# Altium schematic sheet tachometer.SchDoc
size A4; SheetNumber: 1; SheetTotal: 1
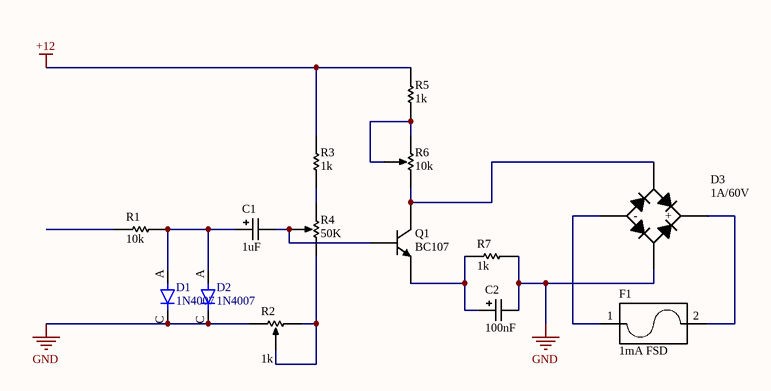
[diagram p0: tachometer.SchDoc]

## Parts
C1  1uF  [CAPAE660X660R_PAN]
C2  100nF  [CAPAE660X660R_PAN]
D1  1N4007  [DIOAD1060W80L520D270]
D2  1N4007  [DIOAD1060W80L520D270]
D3  1A/60V  [SOIC127P670X270-8N_MCC]
F1  1mA FSD  [NANO-452_LIT]
Q1  BC107  [SOT95P230X110-3N_PHY]
R1  10k  [RESC1508X05R_VIS]
R2  1k  [TRIM_ST4ETB503_COP]
R3  1k  [RESC1508X05R_VIS]
R4  50K  [TRIM_ST4ETB503_COP]
R5  1k  [RESC1508X05R_VIS]
R6  10k  [TRIM_ST4ETB503_COP]
R7  1k  [RESC1508X05R_VIS]

## Nets
+12: R3.2 R5.2
GND: C2.2 D1.C D2.C D3.2(C) R2.1 R7.2
NetC1_1: C1.1 D1.A D2.A R1.2
NetC1_2: C1.2 Q1.1(B) R4.3
NetC2_1: C2.1 Q1.2(E) R7.1
NetD3_1: D3.1(+) F1.2
NetD3_3: D3.3(-) F1.1
NetD3_4: D3.4(C) Q1.3(C) R6.2
NetR2_2: R2.2 R2.3 R4.2
NetR3_1: R3.1 R4.1
NetR5_1: R5.1 R6.1 R6.3

Not connected (* = marked no-connect by the designer): R1 1

## Library data of the parts
C1 C2 = 100uF_EEE-TQV101XAP_PAN: CAP ALUM 100UF 35V 20% SMD; Manufacturer_A: PANASONIC; Value_A: 100uF/35V; Package_A: D8; ComponentLink1Description: Datasheet; ComponentLink1URL: DATASHEETS\TP.PDF; PartNumber_A: EEE-TQV101XAP; Code_A: *; Price_A: *; Purchased: *; Supplier_B: *; Code_B: *; Price_B: *; PartNumber_B: *; Value_B: *; Package_B: *; Manufacturer_B: *
D1 D2 = 1N4007: Diode Standard 1000V 1A Through Hole DO-204AL _DO-41_; MF: ON Semiconductor; Package: DO-41 Good-Ark; Value: *; Price: None; MP: 1N4007; Availability: Unavailable; SnapEDA_Link: https://www.snapeda.com/parts/1N4007/ON%20Semiconductor/view-part/2816213/?ref=snap
D3 = MB16S-TP_MCC: DIODE SCHOTTKY 1A 60V MBS-1; Manufacturer_A: MICRO COMERCIAL; Package_A: MBS-1, 4-SOIC; ComponentLink1Description: Datasheet; ComponentLink1URL: DATASHEETS\MB16S.PDF; PartNumber_A: MB16S-TP; Value_A: 1A/60V; Code_A: *; Price_A: *; Purchased: *; Supplier_B: *; Code_B: *; Price_B: *; PartNumber_B: *; Value_B: *; Package_B: *; Manufacturer_B: *
F1 = 2A_0452002.MRL_LIT: FUSE BOARD MNT 2A 125VAC/VDC SMD; Manufacturer_A: LITTELFUSE; Value_A: 2A/125V; ComponentLink1Description: Datasheet; ComponentLink1URL: DATASHEETS\NANO.pdf; PartNumber_A: 0452002.MRL; Code_A: *; Price_A: *; Purchased: *; Supplier_B: *; Code_B: *; Price_B: *; Value_B: *; Package_B: *; Manufacturer_B: *
Q1 = BC817_SOT23: PartNumber_A: BC817; Manufacturer_A: PHYLIPS; Package_A: SOT23; ComponentLink1Description: Datasheet; ComponentLink1URL: DATASHEETS\BC817.pdf; Value_A: *; Code_A: *; Price_A: *; Purchased: *; Supplier_B: *; Code_B: *; Price_B: *; PartNumber_B: *; Value_B: *; Package_B: *; Manufacturer_B: *
R1 R3 R5 R7 = WSL0603R0150FEA_VIS: POWER METAL STRIP RESISTOR 0.1W 1%; Manufacturer_A: VISHAY; Value_A: 15mohm/1%; Package_A: 0603; ComponentLink1Description: Datasheet; ComponentLink1URL: DATASHEETS\WSL.PDF; PartNumber_A: WSL0603R0150FEA; Code_A: *; Price_A: *; Purchased: *; Supplier_B: *; Code_B: *; Price_B: *; PartNumber_B: *; Value_B: *; Package_B: *; Manufacturer_B: *
R2 R4 R6 = 5K_ST4ETB502_COP: TRIMMER 5K OHM 0.25W SMD; Manufacturer_A: COPAL; Value_A: 5K/20%; Package_A: 5X4.4X2.3mm; ComponentLink1Description: Datasheet; ComponentLink1URL: DATASHEETS\ST4.PDF; PartNumber_A: ST4ETB502; Code_A: *; Price_A: *; Purchased: *; Supplier_B: *; Code_B: *; Price_B: *; PartNumber_B: *; Value_B: *; Package_B: *; Manufacturer_B: *; ComponentLink2URL: APP_NOTES\XXXX.PDF; ComponentLink1Description: App_notes